# Altium schematic sheet Jellyfish - Connector and SD Slot.SchDoc
size A
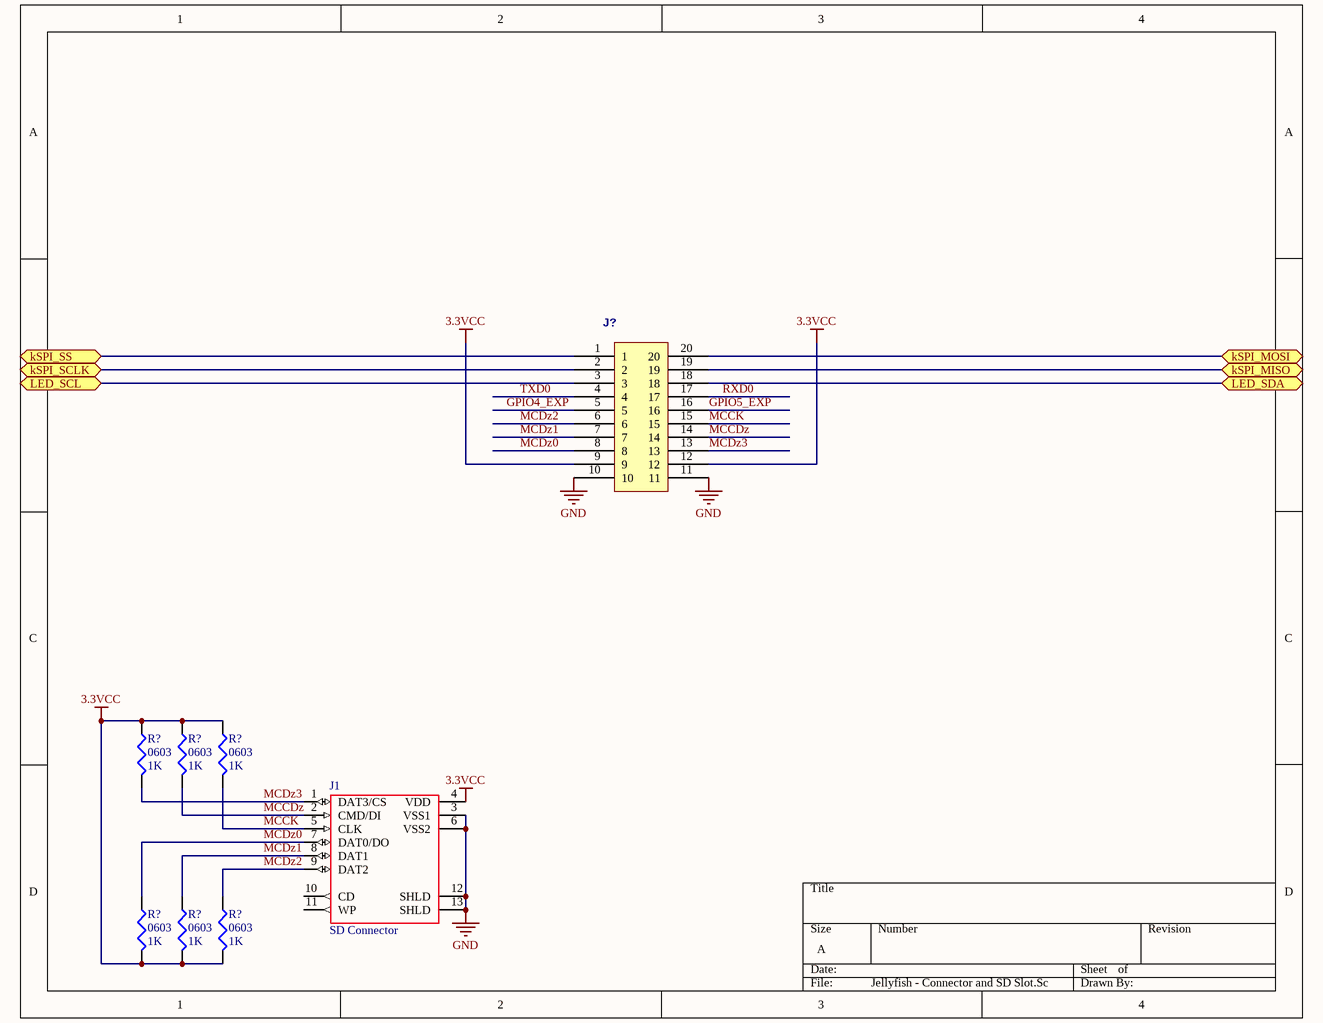
[diagram p0: Jellyfish - Connector and SD Slot.SchDoc]

## Parts
(Parts that share a designator on the sheet are numbered #1, #2 ... from top to bottom, then left to right.)
J1  SD Connector  [SD-Connector]
J?  10X2-0.1X0.05  [10X2-0.05X0.1w]  (value not drawn)
R?#1  0603  value 1K  [J1-0603]
R?#2  0603  value 1K  [J1-0603]
R?#3  0603  value 1K  [J1-0603]
R?#4  0603  value 1K  [J1-0603]
R?#5  0603  value 1K  [J1-0603]
R?#6  0603  value 1K  [J1-0603]

## Ports
kSPI_MISO, kSPI_MOSI, kSPI_SCLK, kSPI_SS, LED_SCL, LED_SDA

## Nets
3.3VCC: J1.4(VDD) J?.9 J?.12 R?#1.1 R?#2.1 R?#3.1 R?#4.2 R?#5.2 R?#6.2
GND: J1.3(VSS1) J1.6(VSS2) J1.12(SHLD) J1.13(SHLD) J?.10 J?.11
GPIO4_EXP: J?.5
GPIO5_EXP: J?.16
kSPI_MISO: J?.19 ; port kSPI_MISO
kSPI_MOSI: J?.20 ; port kSPI_MOSI
kSPI_SCLK: J?.2 ; port kSPI_SCLK
kSPI_SS: J?.1 ; port kSPI_SS
LED_SCL: J?.3 ; port LED_SCL
LED_SDA: J?.18 ; port LED_SDA
MCCDz: J1.2(CMD/DI) J?.14 R?#2.2
MCCK: J1.5(CLK) J?.15 R?#3.2
MCDz0: J1.7(DAT0/DO) J?.8 R?#4.1
MCDz1: J1.8(DAT1) J?.7 R?#5.1
MCDz2: J1.9(DAT2) J?.6 R?#6.1
MCDz3: J1.1(DAT3/CS) J?.13 R?#1.2
RXD0: J?.17
TXD0: J?.4

Not connected (* = marked no-connect by the designer): J1 10(CD) 11(WP)

## Library data of the parts
J1 = SD-connector
J? = 10X2-0.1X0.05: LastRevisionNote: ImportComponents; Published: 23-Apr-2014; Publisher: UltiMachine; LastRevisionDate: 23-Apr-2014
R?#1-R?#6 = Res3: Resistor; Published: 8-Jun-2000; LatestRevisionDate: 29-May-2009; LatestRevisionNote: IPC-7351 Footprint Added.; PackageReference: J1-0603; Publisher: Altium Limited; PackageDescription: Chip Resistor